# Altium project Demo.PrjPcb (part 1 of 2)
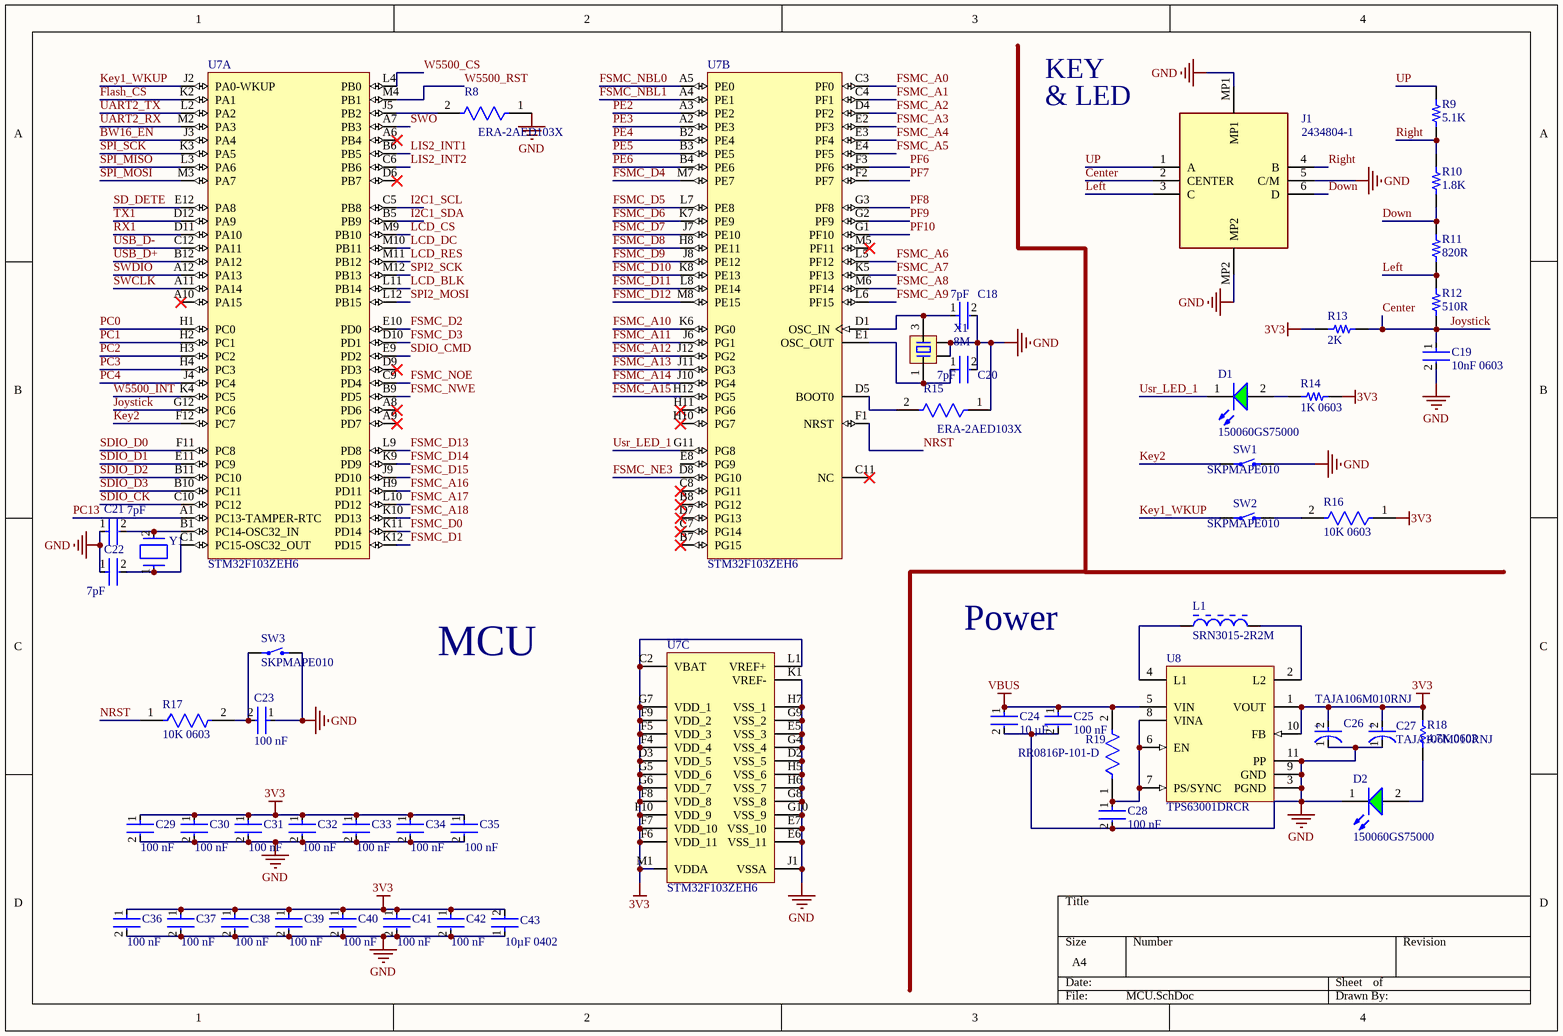
[diagram p0: MCU.SchDoc]
4 sheets, 150 parts. Net scope: global (net labels, ports and power ports of the same name join across sheets).
Board file: PCB1.PcbDoc
Sheets:
  MCU.SchDoc
  Sensors.SchDoc
  Port.SchDoc
  Display_Memory.SchDoc

## Sheet MCU.SchDoc
size A4; SheetNumber: 1; SheetTotal: 4

### Parts
C18  7pF  [FP-GJM155-0_05-IPC_B]
C19  10nF 0603  [FP-CC0603-DA-MFG]
C20  7pF  [FP-GJM155-0_05-IPC_B]
C21  7pF  [FP-GJM155-0_05-IPC_B]
C22  7pF  [FP-GJM155-0_05-IPC_B]
C23  100 nF  [FP-CL10-IPC_A]
C24  10 µF  [FP-CL10-IPC_C]
C25  100 nF  [FP-CL10-IPC_A]
C26  TAJA106M010RNJ  [FP-TAJA-MFG]
C27  TAJA106M010RNJ  [FP-TAJA-MFG]
C28  100 nF  [FP-CL10-IPC_A]
C29  100 nF  [FP-C1005-050-0_05-MFG]
C30  100 nF  [FP-C1005-050-0_05-MFG]
C31  100 nF  [FP-C1005-050-0_05-MFG]
C32  100 nF  [FP-C1005-050-0_05-MFG]
C33  100 nF  [FP-C1005-050-0_05-MFG]
C34  100 nF  [FP-C1005-050-0_05-MFG]
C35  100 nF  [FP-C1005-050-0_05-MFG]
C36  100 nF  [FP-C1005-050-0_05-MFG]
C37  100 nF  [FP-C1005-050-0_05-MFG]
C38  100 nF  [FP-C1005-050-0_05-MFG]
C39  100 nF  [FP-C1005-050-0_05-MFG]
C40  100 nF  [FP-C1005-050-0_05-MFG]
C41  100 nF  [FP-C1005-050-0_05-MFG]
C42  100 nF  [FP-C1005-050-0_05-MFG]
C43  10µF 0402  [FP-CL05A106MP5NUNC-MFG]
D1  150060GS75000  [WL-SMCW_0603_150060xx75000]
D2  150060GS75000  [WL-SMCW_0603_150060xx75000]
J1  2434804-1  [24348041]
L1  SRN3015-2R2M  [BOUR-SRN3015-2_V]
R8  ERA-2AED103X  [FP-ERA2A-IPC_B]
R9  5.1K  [5.1K_0603]
R10  1.8K  [5.1K_0603]
R11  820R  [5.1K_0603]
R12  510R  [5.1K_0603]
R13  2K  [5.1K_0603]
R14  1K 0603  [4.7R]
R15  ERA-2AED103X  [FP-ERA2A-IPC_B]
R16  10K 0603  [FP-RC0603-0_55-IPC_C]
R17  10K 0603  [FP-RC0603-0_55-IPC_C]
R18  4.7K 0603  [RESC1608X55X25LL10T15]
R19  RR0816P-101-D  [FP-RR0816-MFG]
SW1  SKPMAPE010  [KEY-SMD_2P-L6.0-W6.0-P6.00]
SW2  SKPMAPE010  [KEY-SMD_2P-L6.0-W6.0-P6.00]
SW3  SKPMAPE010  [KEY-SMD_2P-L6.0-W6.0-P6.00]
U7  STM32F103ZEH6  [STM-LFBGA144]  (parts A,B,C of 3)
U8  TPS63001DRCR  [DRC0010J_V]
X1  8M  [OSC 3225-4P]
Y1  ABS07-120-32.768KHZ-T  [FP-ABS07-120-MFG]  (value not drawn)

### Nets
3V3: C26.2(A) C27.2(A) C29.1 C30.1 C31.1 C32.1 C33.1 C34.1 C35.1 C36.1 C37.1 C38.1 C39.1 C40.1 C41.1 C42.1 C43.2 R13.2 R14.2 R16.1 R18.2 U7.C2(VBAT) U7.D3(VDD_5) U7.F4(VDD_4) U7.F5(VDD_3) U7.F6(VDD_11) U7.F7(VDD_10) U7.F8(VDD_8) U7.F9(VDD_2) U7.F10(VDD_9) U7.G5(VDD_6) U7.G6(VDD_7) U7.G7(VDD_1) U7.L1(VREF+) U7.M1(VDDA) U8.1(VOUT) U8.10(FB)
GND: C18.2 C19.2 C20.2 C21.1 C22.1 C23.1 C24.2 C25.2 C26.1(C) C27.1(C) C28.2 C29.2 C30.2 C31.2 C32.2 C33.2 C34.2 C35.2 C36.2 C37.2 C38.2 C39.2 C40.2 C41.2 C42.2 C43.1 D2.1(K) J1.5(C/M) J1.MP1 J1.MP2 R8.1 R15.1 SW1.2 SW3.2 U7.D2(VSS_5) U7.E5(VSS_3) U7.E6(VSS_11) U7.E7(VSS_10) U7.G4(VSS_4) U7.G8(VSS_8) U7.G9(VSS_2) U7.G10(VSS_9) U7.H5(VSS_6) U7.H6(VSS_7) U7.H7(VSS_1) U7.J1(VSSA) U7.K1(VREF-) U8.3(PGND) U8.9(GND) U8.11(PP) X1.2 X1.4
VBUS: C24.1 C25.1 R19.2 U8.5(VIN)
BW16_EN: U7.J3(PA4)
Center: C19.1 J1.2(CENTER) R12.1 R13.1 U7.G12(PC6)  [also labelled Joystick]
Down: J1.6(D) R10.1 R11.2
Flash_CS: U7.K2(PA1)
FSMC_A0: U7.C3(PF0)
FSMC_A1: U7.C4(PF1)
FSMC_A2: U7.D4(PF2)
FSMC_A3: U7.E2(PF3)
FSMC_A4: U7.E3(PF4)
FSMC_A5: U7.E4(PF5)
FSMC_A6: U7.L5(PF12)
FSMC_A7: U7.K5(PF13)
FSMC_A8: U7.M6(PF14)
FSMC_A9: U7.L6(PF15)
FSMC_A10: U7.K6(PG0)
FSMC_A11: U7.J6(PG1)
FSMC_A12: U7.J12(PG2)
FSMC_A13: U7.J11(PG3)
FSMC_A14: U7.J10(PG4)
FSMC_A15: U7.H12(PG5)
FSMC_A16: U7.H9(PD11)
FSMC_A17: U7.L10(PD12)
FSMC_A18: U7.K10(PD13)
FSMC_D0: U7.K11(PD14)
FSMC_D1: U7.K12(PD15)
FSMC_D2: U7.E10(PD0)
FSMC_D3: U7.D10(PD1)
FSMC_D4: U7.M7(PE7)
FSMC_D5: U7.L7(PE8)
FSMC_D6: U7.K7(PE9)
FSMC_D7: U7.J7(PE10)
FSMC_D8: U7.H8(PE11)
FSMC_D9: U7.J8(PE12)
FSMC_D10: U7.K8(PE13)
FSMC_D11: U7.L8(PE14)
FSMC_D12: U7.M8(PE15)
FSMC_D13: U7.L9(PD8)
FSMC_D14: U7.K9(PD9)
FSMC_D15: U7.J9(PD10)
FSMC_NBL0: U7.A5(PE0)
FSMC_NBL1: U7.A4(PE1)
FSMC_NE3: U7.D8(PG10)
FSMC_NOE: U7.C9(PD4)
FSMC_NWE: U7.B9(PD5)
I2C1_SCL: U7.C5(PB8)
I2C1_SDA: U7.B5(PB9)
Key1_WKUP: SW2.1 U7.J2(PA0-WKUP)
Key2: SW1.1 U7.F12(PC7)
LCD_BLK: U7.L11(PB14)
LCD_CS: U7.M9(PB10)
LCD_DC: U7.M10(PB11)
LCD_RES: U7.M11(PB12)
Left: J1.3(C) R11.1 R12.2
LIS2_INT1: U7.B6(PB5)
LIS2_INT2: U7.C6(PB6)
NRST: R17.1 U7.F1(NRST)
PC0: U7.H1(PC0)
PC1: U7.H2(PC1)
PC2: U7.H3(PC2)
PC3: U7.H4(PC3)
PC4: U7.J4(PC4)
PC13: U7.A1(PC13-TAMPER-RTC)
PE2: U7.A3(PE2)
PE3: U7.A2(PE3)
PE4: U7.B2(PE4)
PE5: U7.B3(PE5)
PE6: U7.B4(PE6)
PF6: U7.F3(PF6)
PF7: U7.F2(PF7)
PF8: U7.G3(PF8)
PF9: U7.G2(PF9)
PF10: U7.G1(PF10)
Right: J1.4(B) R9.1 R10.2
RX1: U7.D11(PA10)
SD_DETE: U7.E12(PA8)
SDIO_CK: U7.C10(PC12)
SDIO_CMD: U7.E9(PD2)
SDIO_D0: U7.F11(PC8)
SDIO_D1: U7.E11(PC9)
SDIO_D2: U7.B11(PC10)
SDIO_D3: U7.B10(PC11)
SPI2_MOSI: U7.L12(PB15)
SPI2_SCK: U7.M12(PB13)
SPI_MISO: U7.L3(PA6)
SPI_MOSI: U7.M3(PA7)
SPI_SCK: U7.K3(PA5)
SWCLK: U7.A11(PA14)
SWDIO: U7.A12(PA13)
SWO: U7.A7(PB3)
TX1: U7.D12(PA9)
UART2_RX: U7.M2(PA3)
UART2_TX: U7.L2(PA2)
UP: J1.1(A) R9.2
USB_D+: U7.B12(PA12)
USB_D-: U7.C12(PA11)
Usr_LED_1: D1.1(K) U7.G11(PG8)
W5500_CS: U7.L4(PB0)
W5500_INT: U7.K4(PC5)
W5500_RST: U7.M4(PB1)
NetC18_1: C18.1 U7.D1(OSC_IN) X1.3
NetC20_1: C20.1 U7.E1(OSC_OUT) X1.1
NetC21_2: C21.2 U7.B1(PC14-OSC32_IN) Y1.2
NetC22_2: C22.2 U7.C1(PC15-OSC32_OUT) Y1.1
NetC23_2: C23.2 R17.2 SW3.1
NetC28_1: C28.1 R19.1 U8.6(EN) U8.7(PS/SYNC) U8.8(VINA)
NetD1_2: D1.2(A) R14.1
NetD2_2: D2.2(A) R18.1
NetL1_1: L1.1 U8.4(L1)
NetL1_2: L1.2 U8.2(L2)
NetR8_2: R8.2 U7.J5(PB2)
NetR15_2: R15.2 U7.D5(BOOT0)
NetR16_2: R16.2 SW2.2

Not connected (* = marked no-connect by the designer): U7 A6(PB4)* A8(PD6)* A9(PD7)* A10(PA15)* B7(PG15)* B8(PG12)* C7(PG14)* C8(PG11)* C11(NC)* D6(PB7)* D7(PG13)* D9(PD3)* E8(PG9) H10(PG7)* H11(PG6)* M5(PF11)*

### Notes on the sheet
- KEY
- & LED
- Power
- MCU
- (in symbol CMP-2000-07219-2) +

### Library data of the parts
C18 C20-C22 = CMP-2008-03877-2: Multi-Layer Ceramic Capacitor 7pF C0G  ±0.5pF 0402 Paper T/R; Voltage Rating (DC): 50V; Case/Package: 0402; Mount: Surface Mount; Max Operating Temperature: 125°C; Case Code (Imperial): 0402; Min Operating Temperature: -55°C; Width: 0.02inch; Weight: 2.3E-05oz; Termination: SMD/SMT; Package Quantity: 10000; Packaging: Tape and Reel; Thickness: 0.022inch; Dielectric: C0G; Length: 1mm; Voltage Rating: 50V; Height: 0.5mm; Capacitance: 7pF; Radiation Hardening: No; Depth: 0.5mm; Case Code (Metric): 1005
C19 = CMP-2100-03600-2: CAP CER 10000PF 50V X7R 0603; Manufacturer Part Number: CC0603KRX7R9BB103; Manufacturer: YAGEO; Tolerance: 0.1; Material: Ceramic; Temperature Coefficient: 15%; Mouser Description: Multilayer Ceramic Capacitor, CC Series, 0.01 - F, - 10%, X7R, 50 V, 0603 [1608 Metric]; Digikey Description: CAP CER 10000PF 50V X7R 0603; Height: 0.9mm; Category: Cap; Temperature Characteristic: X7R; Footprint Url: http://www.yageo.com/exep/pages/download/literatures/UPY-C_GEN_24.pdf; Lead Free: Yes; Voltage Rating: 50 V; Temperature: -55°C to +125°C; Device Class L3: Ceramic Capacitors; ComponentLink2Description: Datasheet; Voltage: 50 V; Package: CC0603-DA; Octopart: https://octopart.com/cc0603krx7r9bb103-yageo-192938; Automotive: No; Temperature Range High: +125°C; Temperature Range Low: -55°C; Value: 10 nF; RoHS: TRUE; Device Class L1: Passive Components; ComponentLink2URL: http://www.yageo.com/documents/recent/UPY-GPHC_X7R_6.3V-to-50V_18.pdf; Device Class L2: Capacitors; Capacitance: 10 nF
C23 C25 C28 = CMP-13271-004036-1: Cap Ceramic 100nF 100V X7R ±10% Pad SMD 0603 +125°C T/R; Mount: Surface Mount; Packaging: Cut Tape; Width: 0.031inch; Thickness: 0.035inch; Length: 0.063inch; Tolerance: 10%; Min Operating Temperature: -55°C; Case/Package: 0603; Voltage Rating: 100V; Max Operating Temperature: 125°C; Case Code (Metric): 1608; Capacitance: 100nF; Case Code (Imperial): 0603
C24 = CMP-13271-004224-1: Cap Ceramic 10uF 25V X5R ±20% Pad SMD 0603 +85°C T/R; Width: 0.031inch; Voltage Rating: 25V; Length: 0.063inch; Case Code (Metric): 1608; Dielectric: X5R; Termination: Wraparound; Capacitance: 10uF; Lead Free: Lead Free; Mount: Surface Mount; Package Quantity: 1; Case Code (Imperial): 0603; Thickness: 0.035inch; Packaging: Tape and Reel; Contact Plating: Tin; Min Operating Temperature: -55°C; Tolerance: 20%; Max Operating Temperature: 85°C; Case/Package: 0603
C26 C27 = CMP-2000-07219-2: 10uF 10V  ±20% 3Ω 1206  SMD Tantalum Capacitor; Polarity: Polar; ESR (Equivalent Series Resistance): 3R; Dissipation Factor: 6%; Leakage Current: 1uA; Construction: Flat; Packaging: Tape and Reel; Voltage Rating: 10V; Lead Free: Lead Free; Radiation Hardening: No; REACH SVHC: No SVHC; Termination: SMD/SMT; Case/Package: 1206; RoHS Compliant: Yes; Min Operating Temperature: -55°C; Depth: 1.6mm; Voltage Rating (DC): 10V; Series: TAJ; Capacitance: 10uF; Height: 1.6mm; Height - Seated (Max): 0.071inch; Tolerance: 20%; Package Quantity: 1; Voltage: 10V; Features: General Purpose; Max Operating Temperature: 125°C; Lead Pitch: 1.1mm; Dielectric Material: Tantalum; Width: 0.063inch; Mount: Surface Mount; Case Code (Metric): 3216; Case Code (Imperial): 1206; Length: 3.2mm; Number of Pins: 2
C29-C42 = CMP-08246-004802-1: Multilayer Ceramic Capacitors 100nF ±10% 50V X5R SMD 0402; Voltage Rating: 50V; Weight: 2.3E-05oz; Construction: Flat; Dielectric: X5R; Packaging: Tape and Reel; REACH SVHC: No SVHC; Width: 0.02inch; RoHS Compliant: Yes; Capacitance: 100nF; Depth: 0.5mm; Voltage Rating (DC): 50V; Dielectric Material: Ceramic; Height: 0.5mm; Min Operating Temperature: -55°C; Voltage: 50V; Case Code (Imperial): 0402; Tolerance: 10%; Termination: SMD/SMT; Package Quantity: 1; Radiation Hardening: No; Resistor Type: Ceramic; Case/Package: 0402; Length: 1mm; Lead Free: Lead Free; Thickness: 0.022inch; Mount: Surface Mount; Case Code (Metric): 1005; Max Operating Temperature: 85°C; Series: C
C43 = CMP-13271-000002-1: CAP CER 10UF 10V X5R 0402; Manufacturer Part Number: CL05A106MP5NUNC; Manufacturer: Samsung; Temperature Coefficient: 15%; Tolerance: 20%; Material: Ceramic; Octopart: https://octopart.com/cl05a106mp5nunc-samsung-22457395; Voltage Rating: 10V; RoHS: TRUE; Value: 10uF; Height: 0.7mm; Digikey Description: CAP CER 10UF 10V X5R 0402; Automotive: No; Package: CL05A106MP5NUNC; Device Class L1: Passive Components; Capacitance: 10uF; Temperature Range High: +85°C; ComponentLink2Description: Datasheet; Device Class L2: Capacitors; Temperature Characteristic: X5R; Temperature: -55°C to +85°C; ComponentLink2URL: http://www.samsungsem.com/kr/support/product-search/mlcc/__icsFiles/afieldfile/2019/05/10/19-CL05A106MP5NUNC.pdf; Device Class L3: Ceramic Capacitors; Category: Cap; Temperature Range Low: -55°C; Ipc Land Pattern Name: CAPC10050X50; Lead Free: Yes
D1 D2 = CMP-1426-00002-3: NexarPartId: 29687084; Color: Green; Power Dissipation: 105mW; Peak Wavelength: 515nm; Viewing Angle: 140°; Test Current: 20mA; Wavelength: 520nm; Lens Style: Clear, Rectangular; Max Junction Temperature (Tj): 95°C; Luminous Intensity: 430mcd; Output Current: 10µA; Max Reverse Voltage (DC): 5V; Forward Voltage: 3.2V; Dominant Wavelength: 525nm; Forward Current: 100mA; Mount: Surface Mount; Height: 700µm; Lead Free: Lead Free; Min Operating Temperature: -40°C; Max Operating Temperature: 85°C; Length: 1.6mm; Width: 800µm; Case/Package: 0603; Case Code (Imperial): 0603; Case Code (Metric): 1608; Packaging: Tape and Reel; Reverse Voltage: 5V; REACH SVHC: Unknown; RoHS: Compliant
J1 = 2434804-1: Tactile Switches, Extended, Top Actuator Style, NO, Stainless Steel, Silver, Low Profile, 50 mA, 12 VDC; Manufacturer_Name: TE Connectivity; Geometry.Height: 5.7mm; Manufacturer_Part_Number: 2434804-1; Mouser Part Number: 655-2434804-1; Mouser Price/Stock: https://www.mouser.co.uk/ProductDetail/TE-Connectivity-Alcoswitch/2434804-1?qs=amGC7iS6iy%2Ff1nJtCucIMQ%3D%3D; Arrow Part Number: *; Arrow Price/Stock: *; Datasheet Link: https://www.te.com/commerce/DocumentDelivery/DDEController?Action=showdoc&DocId=Customer+Drawing%7F2434804%7FA%7Fpdf%7FEnglish%7FENG_CD_2434804_A.pdf%7F2434804-1
L1 = CMP-0007-00003-1: Semi-shielded Power Inductor, 2.2 uH, +/- 20%, 1.8 A, -40 to 125 degC, 3 x 3 x 1.5 mm SMD, RoHS and Halogen Free, Tape and Reel; Manufacturer: Bourns; Isat: 1.65 A; Rated current: 1.8 A; Inductance: 2.2 uH; Inductance tolerance: +/- 20%; DCR Max: 0.072 Ohm; SRF Min: 90 MHz; Resistance to Solder Heat: +260 degC for 10 sec.; Operating Temperature: -40 to 125 degC; PartNumber: SRN3015-2R2M; Packing: Tape and Reel; ComponentLink3Description: Package Specification; ComponentLink2Description: Datasheet; RoHS: TRUE; ComponentLink3URL: http://www.bourns.com/data/global/pdfs/SRN3015.pdf; PackageDescription: 2-Pin SMD, Body 3 x 3 mm, Height 1.5 mm; ComponentLink1URL: http://www.bourns.com/; ComponentLink1Description: Manufacturer URL; DatasheetVersion: Aug-11; Mounting Technology: Surface Mount; ComponentLink2URL: http://www.bourns.com/data/global/pdfs/SRN3015.pdf; PackageReference: SRN3015
R8 R15 = CMP-2002-05836-2: RES SMD 10K OHM 0.5% 1/16W 0402; Voltage Rating: 25V; Power Rating: 63mW; Resistance: 10kR; Temperature Coefficient: 25ppm/°C; Height: 0.016inch; Military Standard: Not; Width: 0.5mm; Series: ERA-2A; Packaging: Tape and Reel; Number of Terminations: 2; REACH SVHC: No SVHC; RoHS Compliant: Yes; Mount: Surface Mount; Weight: 2.8E-05oz; Resistance Tolerance: 0.5%; Tolerance: 0.5%; Package Quantity: 10000; Min Operating Temperature: -55°C; Case Code (Metric): 1005; Resistor Type: Thin Film; Construction: Rectangular; Depth: 0.5mm; Case Code (Imperial): 0402; Max Power Dissipation: 63mW; Max Operating Temperature: 155°C; Contact Plating: Tin; Length: 1mm; Size Code: 0402; Termination: SMD/SMT; Case/Package: 0402; Voltage Rating (DC): 25V; Lead Free: Lead Free
R9-R13 = 5.1K_0603: SMT Resistor
R14 = 4.7R 0603: SMT Resistor
R16 R17 = CMP-2100-03664-2: RES 10K OHM 1% 1/10W 0603; Voltage Rating: 75V; Voltage Rating (DC): 50V; Resistance: 10kR; Power Rating: 100mW; Temperature Coefficient: 100ppm/°C; Depth: 0.8mm; Termination: SMD/SMT; Resistor Type: Thick Film; Series: RC; Construction: Rectangular; Features: Moisture Resistant; Packaging: Tape and Reel; Min Operating Temperature: -55°C; Number of Terminations: 2; Lead Pitch: 0.3mm; RoHS Compliant: Yes; Case/Package: 0603; Resistance Tolerance: 1%; Military Standard: Not; Weight: 7.1E-05oz; Number of Pins: 2; Tolerance: 1%; Length: 1.6mm; Case Code (Imperial): 0603; Lead Free: Lead Free; Width: 0.8mm; Max Power Dissipation: 100mW; Height: 0.45mm; Max Operating Temperature: 155°C; Case Code (Metric): 1608; Size Code: 0603
R18 = CMP-2000-06942-1: Chip Resistor, 4.7 KOhm, +/- 1%, 0.1 W, -55 to 155 degC, 0603 (1608 Metric), RoHS, Tape and Reel; Manufacturer: Yageo; Power Rating: 100mW; Temperature Coefficient: 100PPM/C; Resistance: 4.7kOhms; Voltage Rating: 50V; Package Reference: 0603; Series: RC; Datasheet Version: Rev. 7, 05/2017; Packaging: Reel; Termination Style: SMD/SMT; Datasheet URL: http://www.yageo.com/documents/recent/PYu-RC_Group_51_RoHS_L_7.pdf; Manufacturer URL: http://www.yageo.com/; Package Description: 2-Pin Surface Mount Device, Body 1.6 x 0.8 mm; Case Code - mm: 1608; Case Code - in: 0603; Mounting Technology: SurfaceMount; Operating Temperature Range: -55Cto+155C; Tolerance: 1%; Product: ThickFilmResistorsGeneralPurpose
R19 = CMP-2000-02416-2: 100Ω ±0.5% 0.0625W 1/16W Chip Resistor 0603 (1608 Metric) Thin Film; Voltage Rating: 75V; Power Rating: 63mW; Resistance: 100R; Temperature Coefficient: 25ppm/°C; Number of Terminations: 2; Resistance Tolerance: 0.5%; Termination: SMD/SMT; Tolerance: 0.5%; Case/Package: 0603; Series: RR; Min Operating Temperature: -55°C; Case Code (Imperial): 0603; Number of Pins: 2; Packaging: Cut Tape; Width: 0.031inch; Resistor Type: Thin Film; RoHS Compliant: Yes; Lead Free: Lead Free; Depth: 0.8mm; Technology: THIN FILM; Size Code: 0603; Voltage Rating (DC): 75V; Package Quantity: 1; Case Code (Metric): 1608; Length: 1.6mm; Height: 0.4mm; Max Operating Temperature: 125°C; Weight: 7.1E-05oz; Max Power Dissipation: 63mW
U7 = CMP-0237-00023-3: ARM Cortex-M3 32-bit MCU, 512 KB Flash, 64 KB Internal RAM, 112 I/Os, 144-pin LFBGA, -40 to 85 degC, Tray; Operating Frequency(F) (Processor speed) (MHz): 72; Internal RAM Size (kB): 64; Supply Voltage(Vcc) min (V): 2; D/A Converter: 2x12-bit (2 Channel); A/D Converter: 3x12-bit (21 Channel); FLASH Size (Prog) (kB): 512; I/Os (High Current): 112; PackageVersion: Rev. 3, 01/2012; Packing: Tray; PackageDescription: 144-Ball Low Profile Fine Pitch BGA, 10 x 10 x 1.7 mm Body, 0.8 mm Pitch; ComponentLink2URL: http://www.st.com/st-web-ui/static/active/en/resource/technical/document/datasheet/CD00191185.pdf; ComponentLink3Description: Package Specification; Core: ARM Cortex-M3; PartNumber: STM32F103ZEH6; ComponentLink1Description: Manufacturer URL; ComponentLink3URL: http://www.st.com/st-web-ui/static/active/en/resource/technical/document/datasheet/CD00253742.pdf; PackageReference: LFBGA144; ComponentLink1URL: http://www.st.com/web/en/home.html; DatasheetVersion: Rev. 8; Mounting Technology: Surface Mount; ComponentLink2Description: Datasheet
U8 = CMP-0345-00006-2: Buck-Boost Voltage Converter with 1.8 to 5.5 V Input and 3.3 V Output, -40 to 85 degC, 10-Pin SON (DRC), Green (RoHS & no Sb/Br); Manufacturer: Texas Instruments; Synchronous Rectification: TRUE; Iq(Typ)(mA): 0.03; Regulated Outputs(#): 1; Preset Vout(V): 3.3; Vin(Min)(V): 1.8; Switching Frequency(Max)(kHz): 1500; Iout(Max)(A): 1.2; SubFamily: Buck-Boost Regulator; Vin(Max)(V): 5.5; PartNumber: TPS63001DRCR; Topology: Buck-Boost; Dynamic Voltage Scaling: TRUE; PackageVersion: revL, Sep-2011; ComponentLink2Description: Package Specification; DatasheetVersion: SLVS520B; Eco-Plan: Green (RoHS & no Sb/Br); ComponentLink1URL: http://www.ti.com/general/docs/lit/getliterature.tsp?genericPartNumber=TPS63001&fileType=pdf; Mounting Technology: Surface Mount; Vout(Min)(V): 3.3; ComponentLink2URL: http://www.ti.com/litv/pdf/mpds117k; PackageDescription: 10-Pin Plastic Small Outline No-Lead, 3 x 3 x 1 mm Body, 0.5 mm Pitch, Exposed Pad; PackageReference: DRC0010J; Vout(Max)(V): 3.3; ComponentLink1Description: Datasheet
X1 = XTAL-4P: BOM名称: 4脚无源晶振; 版权归属: 源创客; 学习资源: www.ooocke.com
Y1 = CMP-2000-07587-2: CRYSTAL 32.7680KHZ 6PF SMD; Frequency Tolerance: 20ppm; Series Resistance: 60kR; ESR (Equivalent Series Resistance): 55kR; Depth: 1.5mm; Width: 0.061inch; Number of Pins: 2; Max Operating Temperature: 85°C; Length: 3.2mm; Case/Package: SMD/SMT; Series: ABS07; Lead Free: Lead Free; Min Operating Temperature: -40°C; Load Capacitance: 6pF; Packaging: Tape and Reel; Height: 0.035inch; Radiation Hardening: No; Tolerance: 20ppm; Operating Frequency: 32.768 kHz; Termination: SMD/SMT; REACH SVHC: No SVHC; RoHS Compliant: Yes; Frequency: 32.768kHz; Package Quantity: 3000; Mount: Surface Mount

## Sheet Sensors.SchDoc
size A4; SheetNumber: 2; SheetTotal: 4
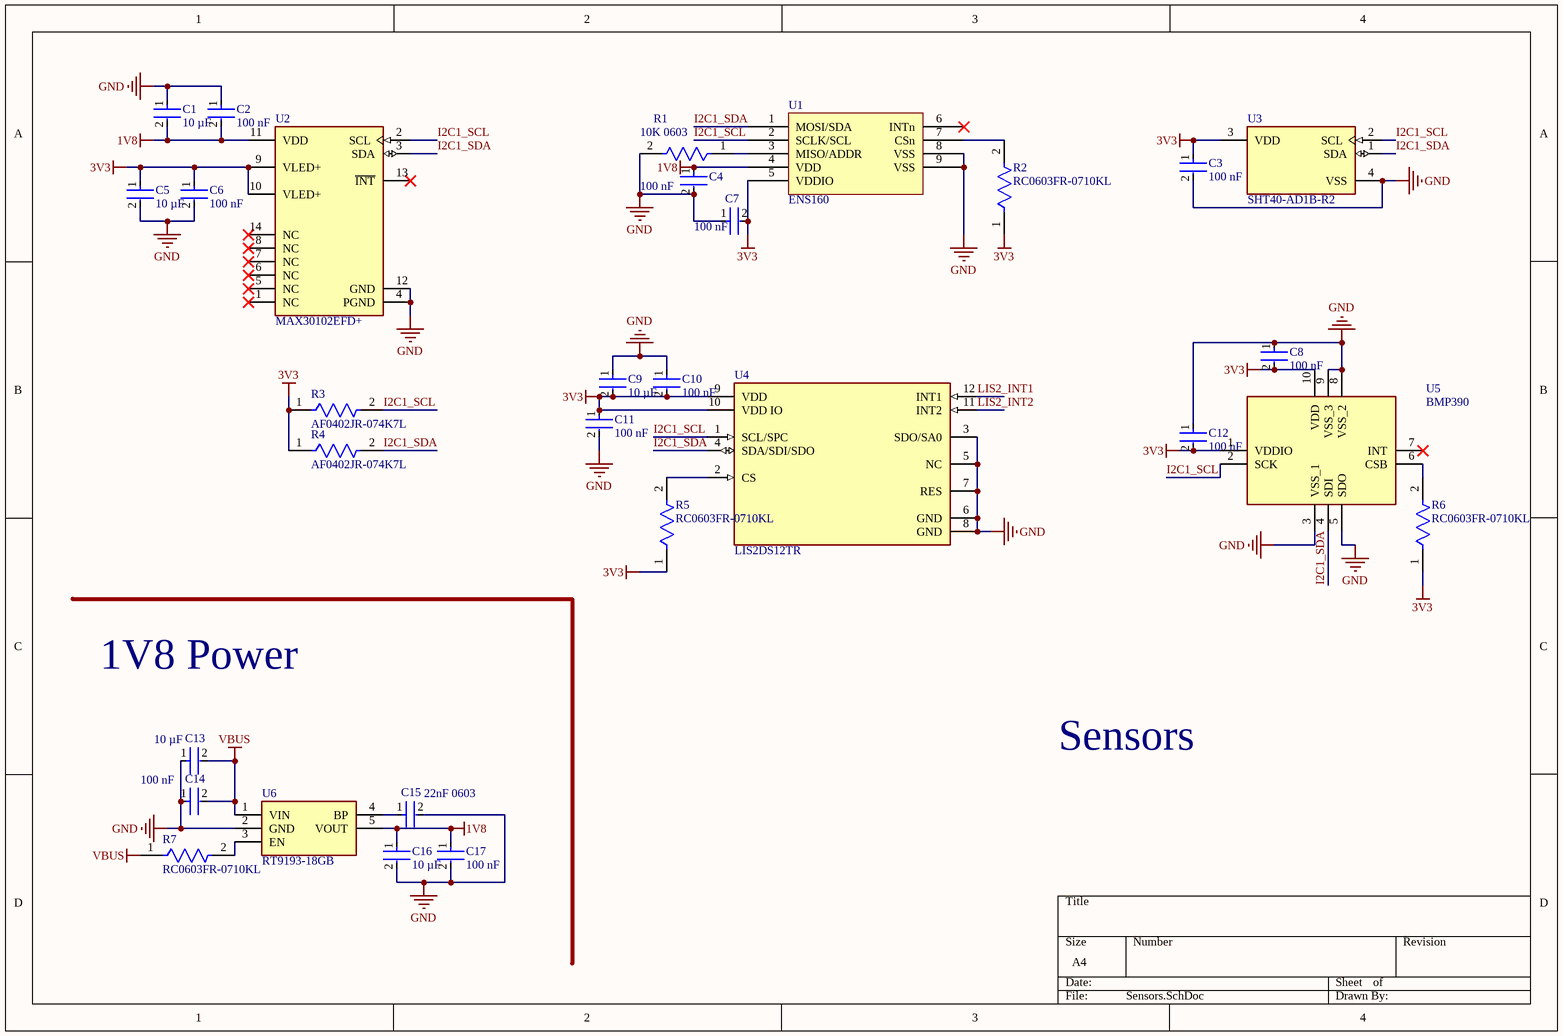
[diagram p1: Sensors.SchDoc]

### Parts
C1  10 µF  [FP-CL10-IPC_C]
C2  100 nF  [FP-CL10-IPC_A]
C3  100 nF  [FP-CL10-IPC_A]
C4  100 nF  [FP-CL10-IPC_A]
C5  10 µF  [FP-CL10-IPC_C]
C6  100 nF  [FP-CL10-IPC_A]
C7  100 nF  [FP-CL10-IPC_A]
C8  100 nF  [FP-CL10-IPC_A]
C9  10 µF  [FP-CL10-IPC_C]
C10  100 nF  [FP-CL10-IPC_A]
C11  100 nF  [FP-CL10-IPC_A]
C12  100 nF  [FP-CL10-IPC_A]
C13  10 µF  [FP-CL10-IPC_C]
C14  100 nF  [FP-CL10-IPC_A]
C15  22nF 0603  [FP-0603-L_1_6_0_15-W_0_81-IPC_C]
C16  10 µF  [FP-CL10-IPC_C]
C17  100 nF  [FP-CL10-IPC_A]
R1  10K 0603  [FP-RC0603-0_55-IPC_C]
R2  RC0603FR-0710KL  [FP-RC0603-0_55-IPC_C]
R3  AF0402JR-074K7L  [FP-AF0402-IPC_B]
R4  AF0402JR-074K7L  [FP-AF0402-IPC_B]
R5  RC0603FR-0710KL  [FP-RC0603-0_55-IPC_C]
R6  RC0603FR-0710KL  [FP-RC0603-0_55-IPC_C]
R7  RC0603FR-0710KL  [FP-RC0603-0_55-IPC_C]
U1  ENS160  [ENS_160]
U2  MAX30102EFD+  [FP-F143A5-1-MFG]
U3  SHT40-AD1B-R2  [FP-SHT40-AD1B-R2-MFG]
U4  LIS2DS12TR  [FP-LGA12_8566956-MFG]
U5  BMP390  [BMP390]
U6  RT9193-18GB  [SOT94P279X130-5N]

### Nets
1V8: C1.2 C2.2 C4.1 C16.1 C17.1 U1.4(VDD) U2.11(VDD) U6.5(VOUT)
3V3: C3.1 C5.1 C6.1 C7.2 C8.2 C9.2 C10.2 C11.1 C12.2 R2.1 R3.1 R4.1 R5.1 R6.1 U1.5(VDDIO) U2.9(VLED+) U2.10(VLED+) U3.3(VDD) U4.9(VDD) U4.10(VDD_IO) U5.1(VDDIO) U5.10(VDD)
GND: C1.1 C2.1 C3.2 C4.2 C5.2 C6.2 C7.1 C8.1 C9.1 C10.1 C11.2 C12.1 C13.1 C14.1 C15.2 C16.2 C17.2 R1.2 U1.8(VSS) U1.9(VSS) U2.4(PGND) U2.12(GND) U3.4(VSS) U4.3(SDO/SA0) U4.5(NC) U4.6(GND) U4.7(RES) U4.8(GND) U5.3(VSS_1) U5.5(SDO) U5.8(VSS_2) U5.9(VSS_3) U6.2(GND)
VBUS: C13.2 C14.2 R7.1 U6.1(VIN)
I2C1_SCL: R3.2 U1.2(SCLK/SCL) U2.2(SCL) U3.2(SCL) U4.1(SCL/SPC) U5.2(SCK)
I2C1_SDA: R4.2 U1.1(MOSI/SDA) U2.3(SDA) U3.1(SDA) U4.4(SDA/SDI/SDO) U5.4(SDI)
LIS2_INT1: U4.12(INT1)
LIS2_INT2: U4.11(INT2)
NetC15_1: C15.1 U6.4(BP)
NetR1_1: R1.1 U1.3(MISO/ADDR)
NetR2_2: R2.2 U1.7(CSn)
NetR5_2: R5.2 U4.2(CS)
NetR6_2: R6.2 U5.6(CSB)
NetR7_2: R7.2 U6.3(EN)

Not connected (* = marked no-connect by the designer): U1 6(INTn)*; U2 1(NC)* 5(NC)* 6(NC)* 7(NC)* 8(NC)* 13(~{INT})* 14(NC)*; U5 7(INT)*

### Notes on the sheet
- 1V8 Power
- Sensors

### Library data of the parts
C1 C5 C9 C13 C16 = CMP-13271-004224-1: as C24 on sheet MCU; Width: 0.031inch; Voltage Rating: 25V; Length: 0.063inch; Case Code (Metric): 1608; Dielectric: X5R; Termination: Wraparound; Capacitance: 10uF; Lead Free: Lead Free; Mount: Surface Mount; Package Quantity: 1; Case Code (Imperial): 0603; Thickness: 0.035inch; Packaging: Tape and Reel; Contact Plating: Tin; Min Operating Temperature: -55°C; Tolerance: 20%; Max Operating Temperature: 85°C; Case/Package: 0603
C2-C4 C6-C8 C10-C12 C14 C17 = CMP-13271-004036-1: as C23 on sheet MCU; Mount: Surface Mount; Packaging: Cut Tape; Width: 0.031inch; Thickness: 0.035inch; Length: 0.063inch; Tolerance: 10%; Min Operating Temperature: -55°C; Case/Package: 0603; Voltage Rating: 100V; Max Operating Temperature: 125°C; Case Code (Metric): 1608; Capacitance: 100nF; Case Code (Imperial): 0603
C15 = CMP-2006-04170-2: General Purpose Ceramic Capacitor, 0603, 22nF, 10%, X7R, 15%, 25V; Max Operating Temperature: 125°C; Lead Free: Lead Free; Voltage Rating (DC): 25V; Packaging: Tape and Reel; Thickness: 0.035inch; Length: 1.6mm; Series: -; Dielectric: X7R; Min Operating Temperature: -55°C; Mount: Surface Mount; Tolerance: 10%; Contact Plating: Tin; Construction: Flat; Package Quantity: 1; Case Code (Imperial): 0603; Number of Pins: 2; Termination: SMD/SMT; Case/Package: 0603; Radiation Hardening: No; Dielectric Material: Ceramic; Case Code (Metric): 1608; Width: 0.032inch; Height: 0.9mm; Depth: 0.81mm; Capacitance: 22nF; Voltage: 25V; RoHS Compliant: Yes; Voltage Rating: 25V
R1 R2 R5-R7 = CMP-2100-03664-2: as R16 on sheet MCU; Depth: 0.8mm; Termination: SMD/SMT; Resistor Type: Thick Film; Series: RC; Construction: Rectangular; Features: Moisture Resistant; Packaging: Tape and Reel; Min Operating Temperature: -55°C; Number of Terminations: 2; Lead Pitch: 0.3mm; RoHS Compliant: Yes; Case/Package: 0603; Resistance Tolerance: 1%; Military Standard: Not; Weight: 7.1E-05oz; Number of Pins: 2; Tolerance: 1%; Length: 1.6mm; Case Code (Imperial): 0603; Lead Free: Lead Free; Width: 0.8mm; Max Power Dissipation: 100mW; Height: 0.45mm; Max Operating Temperature: 155°C; Case Code (Metric): 1608; Size Code: 0603
R3 R4 = CMP-03412-040740-1: Anti-Sulfurated Chip Resistors Automotive Grade 4.7kΩ 5% 100ppm/°C 0402; Voltage Rating: 50V; Power Rating: 62.5mW; Max Power Dissipation: 63mW; Resistance: 4.7kR; Width: 0.5mm; Case Code (Imperial): 0402; Package Quantity: 10000; Max Operating Temperature: 155°C; Features: Moisture Resistant; Length: 0.039inch; Height: 0.015inch; RoHS Compliant: Yes; Temperature Coefficient: 100ppm/°C; Resistor Type: Thick Film; Weight: 2.3E-05oz; Case Code (Metric): 1005; Packaging: Tape and Reel; Series: AF; Termination: SMD/SMT; Tolerance: 5%; Case/Package: 0402; Number of Terminations: 2; Min Operating Temperature: -55°C
U2 = CMP-05738-000003-1: IC SENSOR OXIMETER/HEARTRATE; Manufacturer: Maxim Integrated; Max Supply Voltage: 2V; Operating Supply Current: 600uA; Min Supply Voltage: 1.7V; Sensor Output: I2C; Max Junction Temp: +90°C; Category: IC; Automotive: No; Height: 1.65mm; Temperature Range Low: -40°C; Footprint Url: https://pdfserv.maximintegrated.com/land_patterns/90-0602.PDF; Octopart: https://octopart.com/max30102efd%2B-maxim+integrated-59568799; Temperature: -40°C to +85°C; ComponentLink2URL: https://datasheets.maximintegrated.com/en/ds/MAX30102.pdf; ComponentLink2Description: Datasheet; Device Class L3: unset; Device Class L2: unset; Mouser Description: Pulse Oximeter/Heart Rate Sensor, Oesip; Lead Free: Yes; Digikey Description: IC SENSOR OXIMETER/HEARTRATE; Package: F143A5-1; Manufacturer Part Number: MAX30102EFD+; RoHS: TRUE; Device Class L1: Sensors; Temperature Range High: +85°C
U3 = CMP-144040-000008-1: SENSOR HUMIDITY 100 RH SMD
U4 = CMP-12175-000010-1: ACCEL 2-16G I2C/SPI 12LGA; Operating Supply Voltage: 1.98V; Bandwidth: 6.25Hz; Axis: X, Y, Z; Output Type: SPI; Case/Package: LGA; Min Operating Temperature: -40°C; Lead Free: Lead Free; Mount: Surface Mount; Max Operating Temperature: 85°C; Contact Plating: Gold; Number of Pins: 12; Packaging: Tape and Reel
U5 = BMP390: Board Mount Pressure Sensors
U6 = RT9193-18GB: IC REG LINEAR 1.8V 300MA SOT23-5; Manufacturer_Name: RICHTEK; Geometry.Height: 1.295mm; Manufacturer_Part_Number: RT9193-18GB; Mouser Part Number: *; Mouser Price/Stock: *; Arrow Part Number: *; Arrow Price/Stock: *; Datasheet Link: http://www.richtek.com/assets/product_file/RT9193/DS9193-17.pdf

## Sheet Port.SchDoc
size A4; SheetNumber: 3; SheetTotal: 4
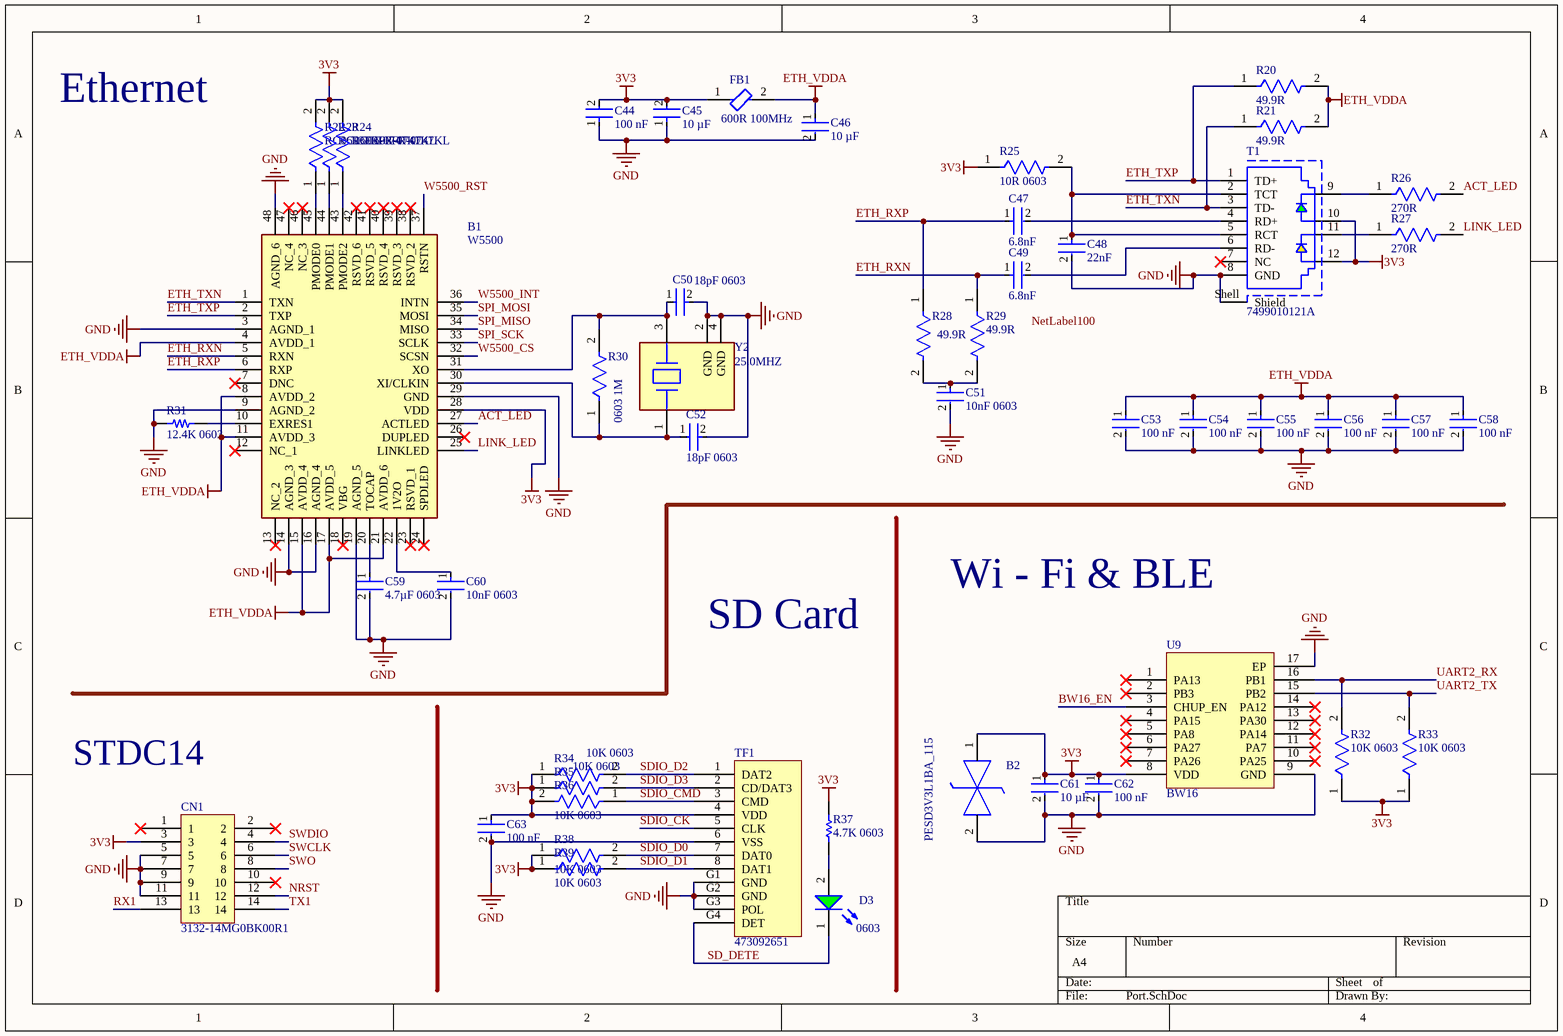
[diagram p2: Port.SchDoc]

### Parts
B1  W5500  [W5500]
B2  PESD3V3L1BA_115  [SOD2512X110N]
C44  100 nF  [FP-CL10-IPC_A]
C45  10 µF  [FP-CL10-IPC_C]
C46  10 µF  [FP-CL10-IPC_C]
C47  6.8nF  [FP-CC0603-DA-MFG]
C48  22nF  [FP-CC0603-DA-MFG]
C49  6.8nF  [FP-CC0603-DA-MFG]
C50  18pF 0603  [FP-C1608-080-0_1-IPC_C]
C51  10nF 0603  [FP-CC0603-DA-MFG]
C52  18pF 0603  [FP-C1608-080-0_1-IPC_C]
C53  100 nF  [FP-CL10-IPC_A]
C54  100 nF  [FP-CL10-IPC_A]
C55  100 nF  [FP-CL10-IPC_A]
C56  100 nF  [FP-CL10-IPC_A]
C57  100 nF  [FP-CL10-IPC_A]
C58  100 nF  [FP-CL10-IPC_A]
C59  4.7µF 0603  [FP-C0603-CG-MFG]
C60  10nF 0603  [FP-CC0603-DA-MFG]
C61  10 µF  [FP-CL10-IPC_C]
C62  100 nF  [FP-CL10-IPC_A]
C63  100 nF  [FP-CL10-IPC_A]
CN1  3132-14MG0BK00R1  [STDC14 Header]
D3  0603  [WL-SMCW_0603_150060xx75000]
FB1  600R 100MHz  [FP-BLM18-0_15-t0_8-MFG]
R20  49.9R  [FP-RT0603-MFG]
R21  49.9R  [FP-RT0603-MFG]
R22  RC0603FR-0747KL  [FP-RC0603FR-0747KL-MFG]
R23  RC0603FR-0747KL  [FP-RC0603FR-0747KL-MFG]
R24  RC0603FR-0747KL  [FP-RC0603FR-0747KL-MFG]
R25  10R 0603  [FP-RT0603-MFG]
R26  270R  [FP-RT0603-MFG]
R27  270R  [FP-RT0603-MFG]
R28  49.9R  [FP-RT0603-MFG]
R29  49.9R  [FP-RT0603-MFG]
R30  0603 1M  [FP-RC0603-0_55-IPC_C]
R31  12.4K 0603  [4.7R]
R32  10K 0603  [FP-RC0603-0_55-IPC_C]
R33  10K 0603  [FP-RC0603-0_55-IPC_C]
R34  10K 0603  [FP-RC0603-0_55-IPC_C]
R35  10K 0603  [FP-RC0603-0_55-IPC_C]
R36  10K 0603  [FP-RC0603-0_55-IPC_C]
R37  4.7K 0603  [RESC1608X55X25LL10T15]
R38  10K 0603  [FP-RC0603-0_55-IPC_C]
R39  10K 0603  [FP-RC0603-0_55-IPC_C]
T1  7499010121A  [7499010121A]
TF1  473092651  [TF-SMD_47309-2285]
U9  BW16  [BW16]
Y2  25.0MHZ  [FP-ABM8G-MFG]

### Nets
3V3: B1.28(VDD) B2.1(K1) C44.2 C45.2 C61.1 C62.1 C63.1 CN1.3 FB1.1 R22.2 R23.2 R24.2 R25.1 R32.1 R33.1 R34.1 R35.1 R36.2 R37.1 R38.1 R39.1 T1.10 T1.12 TF1.4(VDD) U9.8(VDD)
ETH_VDDA: B1.4(AVDD_1) B1.8(AVDD_2) B1.11(AVDD_3) B1.15(AVDD_4) B1.17(AVDD_5) B1.21(AVDD_6) C46.1 C53.1 C54.1 C55.1 C56.1 C57.1 C58.1 FB1.2 R20.2 R21.2
GND: B1.3(AGND_1) B1.9(AGND_2) B1.14(AGND_3) B1.16(AGND_4) B1.19(AGND_5) B1.29(GND) B1.48(AGND_6) B2.2(K2) C44.1 C45.1 C46.2 C48.2 C50.2 C51.2 C52.2 C53.2 C54.2 C55.2 C56.2 C57.2 C58.2 C59.2 C60.2 C61.2 C62.2 C63.2 CN1.5 CN1.7 CN1.9 CN1.11 R31.2 T1.8(GND) T1.Shell(Shield) TF1.6(VSS) TF1.G1(GND) TF1.G2(GND) TF1.G3(POL) U9.9(GND) U9.17(EP) Y2.2(GND) Y2.4(GND)
ACT_LED: B1.27(ACTLED) R26.2
BW16_EN: U9.3(CHUP_EN)
ETH_RXN: B1.5(RXN) C49.1 R29.1
ETH_RXP: B1.6(RXP) C47.1 R28.1
ETH_TXN: B1.1(TXN) R21.1 T1.3(TD-)
ETH_TXP: B1.2(TXP) R20.1 T1.1(TD+)
LINK_LED: B1.25(LINKLED) R27.2
NRST: CN1.12
RX1: CN1.13
SD_DETE: D3.1(K) TF1.G4(DET)
SDIO_CK: TF1.5(CLK)
SDIO_CMD: R36.1 TF1.3(CMD)
SDIO_D0: R38.2 TF1.7(DAT0)
SDIO_D1: R39.2 TF1.8(DAT1)
SDIO_D2: R34.2 TF1.1(DAT2)
SDIO_D3: R35.2 TF1.2(CD/DAT3)
SPI_MISO: B1.34(MISO)
SPI_MOSI: B1.35(MOSI)
SPI_SCK: B1.33(SCLK)
SWCLK: CN1.6
SWDIO: CN1.4
SWO: CN1.8
TX1: CN1.14
UART2_RX: R32.2 U9.16(PB1)
UART2_TX: R33.2 U9.15(PB2)
W5500_CS: B1.32(SCSN)
W5500_INT: B1.36(INTN)
W5500_RST: B1.37(RSTN)
NetB1_10: B1.10(EXRES1) R31.1
NetB1_20: B1.20(TOCAP) C59.1
NetB1_22: B1.22(1V2O) C60.1
NetB1_30: B1.30(XI/CLKIN) C52.1 R30.1 Y2.1
NetB1_31: B1.31(XO) C50.1 R30.2 Y2.3
NetB1_43: B1.43(PMODE2) R24.1
NetB1_44: B1.44(PMODE1) R23.1
NetB1_45: B1.45(PMODE0) R22.1
NetC47_2: C47.2 T1.4(RD+)
NetC48_1: C48.1 R25.2 T1.2(TCT) T1.5(RCT)
NetC49_2: C49.2 T1.6(RD-)
NetC51_1: C51.1 R28.2 R29.2
NetD3_2: D3.2(A) R37.2
NetR26_1: R26.1 T1.9
NetR27_1: R27.1 T1.11

Not connected (* = marked no-connect by the designer): B1 7(DNC)* 12(NC_1)* 13(NC_2)* 18(VBG)* 23(RSVD_1)* 24(SPDLED)* 26(DUPLED)* 38(RSVD_2)* 39(RSVD_3)* 40(RSVD_4)* 41(RSVD_5)* 42(RSVD_6)* 46(NC_3)* 47(NC_4)*; CN1 1* 2* 10*; T1 7(NC)*; U9 1(PA13)* 2(PB3)* 4(PA15)* 5(PA8)* 6(PA27)* 7(PA26)* 10(PA25)* 11(PA7)* 12(PA14)* 13(PA30)* 14(PA12)*

### Notes on the sheet
- Ethernet
- SD Card
- Wi - Fi & BLE
- STDC14
- Labels drawn without touching a wire or pin: NetLabel100

### Library data of the parts
B1 = W5500: Ethernet ICs 3in1 Enet Controller TCP/IP +MAC+PHY; Manufacturer_Name: WIZnet Inc; Geometry.Height: 1.6mm; Manufacturer_Part_Number: W5500; Mouser Part Number: 950-W5500; Mouser Price/Stock: https://www.mouser.co.uk/ProductDetail/WIZnet/W5500?qs=2vh%252B45pPFtzthUpYPd4pqA%3D%3D; Arrow Part Number: *; Arrow Price/Stock: *; Datasheet Link: http://wizwiki.net/wiki/lib/exe/fetch.php?media=products:w5500:w5500_ds_v106e_141230.pdf
B2 = PESD3V3L1BA_115: PESD3V3L1BA - Low capacitance bidirectional ESD protection diode in SOD323; Manufacturer_Name: Nexperia; Manufacturer_Part_Number: PESD3V3L1BA,115; Geometry.Height: 1.1mm; Mouser Part Number: 771-PESD3V3L1BA-T/R; Mouser Price/Stock: https://www.mouser.co.uk/ProductDetail/Nexperia/PESD3V3L1BA115?qs=LOCUfHb8d9tfcQwAsqvzKg%3D%3D; Arrow Part Number: PESD3V3L1BA,115; Arrow Price/Stock: https://www.arrow.com/en/products/pesd3v3l1ba115/nexperia?region=nac; Datasheet Link: https://assets.nexperia.com/documents/data-sheet/PESDXL1BA_SER.pdf
C44 C53-C58 C62 C63 = CMP-13271-004036-1: as C23 on sheet MCU; Mount: Surface Mount; Packaging: Cut Tape; Width: 0.031inch; Thickness: 0.035inch; Length: 0.063inch; Tolerance: 10%; Min Operating Temperature: -55°C; Case/Package: 0603; Voltage Rating: 100V; Max Operating Temperature: 125°C; Case Code (Metric): 1608; Capacitance: 100nF; Case Code (Imperial): 0603
C45 C46 C61 = CMP-13271-004224-1: as C24 on sheet MCU; Width: 0.031inch; Voltage Rating: 25V; Length: 0.063inch; Case Code (Metric): 1608; Dielectric: X5R; Termination: Wraparound; Capacitance: 10uF; Lead Free: Lead Free; Mount: Surface Mount; Package Quantity: 1; Case Code (Imperial): 0603; Thickness: 0.035inch; Packaging: Tape and Reel; Contact Plating: Tin; Min Operating Temperature: -55°C; Tolerance: 20%; Max Operating Temperature: 85°C; Case/Package: 0603
C47 C49 = CMP-03422-000576-1: CAP CER 6800PF 50V X7R 0603; Manufacturer Part Number: CC0603KRX7R9BB682; Manufacturer: YAGEO; Temperature Coefficient: 15%; Tolerance: 0.1; Material: Ceramic; Digikey Description: CAP CER 6800PF 50V X7R 0603; Footprint Url: http://www.yageo.com/exep/pages/download/literatures/UPY-C_GEN_24.pdf; Automotive: No; Octopart: https://octopart.com/cc0603krx7r9bb682-yageo-39467723; Lead Free: Yes; Temperature: -55°C to +125°C; RoHS: TRUE; Temperature Range High: +125°C; Package: CC0603-DA; Value: 6.8 nF; Height: 0.9mm; Temperature Range Low: -55°C; ComponentLink2Description: Datasheet; Category: Cap; Device Class L1: Passive Components; Device Class L2: Capacitors; Voltage: 50 V; Temperature Characteristic: X7R; Capacitance: 6.8 nF; Device Class L3: Ceramic Capacitors; Mouser Description: Multilayer Ceramic Capacitors MLCC - SMD/SMT 6.8nF 50V X7R 10%; Voltage Rating: 50 V; ComponentLink2URL: http://www.yageo.com/documents/recent/UPY-GPHC_X7R_6.3V-to-50V_18.pdf
C48 = CMP-2100-03602-3: CAP CER 0.022UF 50V X7R 0603; Dielectric Material: Ceramic; Insulation Resistance: 100GR; Tolerance: 10%; Thickness: 0.035inch; Case/Package: 0603; Packaging: Tape and Reel; Voltage Rating (DC): 50V; Length: 1.6mm; Depth: 0.8mm; Dielectric: X7R; Resistor Type: Ceramic; Min Operating Temperature: -55°C; Number of Pins: 2; Series: CC; Mount: Surface Mount; Max Operating Temperature: 125°C; Capacitance: 22nF; Case Code (Imperial): 0603; Width: 0.031inch; Halogen Free: Halogen Free; Lead Free: Lead Free; Voltage: 50V; RoHS Compliant: Yes; Package Quantity: 1; Height: 0.8mm; REACH SVHC: No SVHC; Voltage Rating: 50V; Case Code (Metric): 1608; Termination: SMD/SMT; Radiation Hardening: No
C50 C52 = CMP-08246-003585-1: Multilayer Ceramic Capacitors 18pF ±5% 50V C0G SMD 0603; Temperature Coefficient: 30ppm/°C; Height: 0.8mm; Packaging: Tape and Reel; Capacitance: 18pF; Min Operating Temperature: -55°C; Lead Free: Lead Free; Depth: 0.8mm; Length: 1.6mm; Voltage Rating: 50V; Weight: 7.1E-05oz; Radiation Hardening: No; Max Operating Temperature: 125°C; Voltage: 50V; Dielectric: C0G; Voltage Rating (DC): 50V; Case Code (Imperial): 0603; Number of Pins: 2; Mount: Surface Mount; Tolerance: 5%; Width: 0.031inch; RoHS Compliant: Yes; Series: C; Thickness: 0.037inch; Construction: Flat; Case Code (Metric): 1608; Case/Package: 0603; Package Quantity: 1; Dielectric Material: Ceramic; REACH SVHC: No SVHC; Termination: SMD/SMT
C51 C60 = CMP-2100-03600-2: as C19 on sheet MCU; Mouser Description: Multilayer Ceramic Capacitor, CC Series, 0.01 - F, - 10%, X7R, 50 V, 0603 [1608 Metric]; Digikey Description: CAP CER 10000PF 50V X7R 0603; Height: 0.9mm; Category: Cap; Temperature Characteristic: X7R; Footprint Url: http://www.yageo.com/exep/pages/download/literatures/UPY-C_GEN_24.pdf; Lead Free: Yes; Voltage Rating: 50 V; Temperature: -55°C to +125°C; Device Class L3: Ceramic Capacitors; ComponentLink2Description: Datasheet; Voltage: 50 V; Package: CC0603-DA; Octopart: https://octopart.com/cc0603krx7r9bb103-yageo-192938; Automotive: No; Temperature Range High: +125°C; Temperature Range Low: -55°C; Value: 10 nF; RoHS: TRUE; Device Class L1: Passive Components; ComponentLink2URL: http://www.yageo.com/documents/recent/UPY-GPHC_X7R_6.3V-to-50V_18.pdf; Device Class L2: Capacitors; Capacitance: 10 nF
C59 = CMP-2006-02256-2: CAP CER 4.7UF 6.3V X5R 0603; Manufacturer: Kemet; Manufacturer Part Number: C0603C475K9PACTU; Temperature Coefficient: 15%; Tolerance: 10%; Material: Ceramic; Device Class L3: Ceramic Capacitors; RoHS: TRUE; Value: 4.7uF; Lead Free: Yes; ComponentLink2Description: Datasheet; Mouser Description: Multilayer Ceramic Capacitors MLCC - SMD/SMT 6.3volts 4.7uF X5R 10%; Package: C0603-CG; Digikey Description: CAP CER 4.7UF 6.3V X5R 0603; ComponentLink2URL: https://content.kemet.com/datasheets/KEM_C1006_X5R_SMD.pdf; Category: Cap; Temperature Range Low: -55°C; Capacitance: 4.7uF; Temperature: -55°C to +85°C; Octopart: https://octopart.com/c0603c475k9pactu-kemet-104242; Ipc Land Pattern Name: CAPC16080X80; Voltage Rating: 6.3V; Temperature Range High: +85°C; Height: 0.9mm; Temperature Characteristic: X5R; Device Class L1: Passive Components; Automotive: No; Device Class L2: Capacitors
CN1 = STDC-14
D3 = CMP-1426-00002-3: as D1 on sheet MCU; Mount: Surface Mount; Height: 700µm; Lead Free: Lead Free; Min Operating Temperature: -40°C; Max Operating Temperature: 85°C; Length: 1.6mm; Width: 800µm; Case/Package: 0603; Case Code (Imperial): 0603; Case Code (Metric): 1608; Packaging: Tape and Reel; Reverse Voltage: 5V; REACH SVHC: Unknown; RoHS: Compliant
FB1 = CMP-0686-00436-3: Chip Ferrite Bead, 0603, 600Ω @ 100MHz, 0.38Ω, 25%, 500mA; Number of Lines: 1; DC Resistance (DCR): 380mR; Material: Steel; Shielding: Unshielded; Max DC Current: 500mA; Termination: SMD/SMT; Military Standard: Not; Number of Circuits: 1; Min Operating Temperature: -55°C; Case Code (Imperial): 0603; Width: 0.8mm; Current Rating: 500mA; Lead Free: Lead Free; Packaging: Tape and Reel; Frequency: 100MHz; Max Operating Temperature: 125°C; DC Current: 500mA; REACH SVHC: No SVHC; Case/Package: 0603; Package Quantity: 1; Height: 0.8mm; Number of Pins: 2; Impedance: 600R; Depth: 0.8mm; Test Frequency: 100MHz; Case Code (Metric): 1608; Tolerance: 25%; Core Material: Ferrite; Weight: 7.1E-05oz; Max Current Rating: 500mA; Radiation Hardening: No; Length: 1.6mm; RoHS Compliant: Yes
R20 R21 R28 R29 = CMP-03412-034007-1: RES SMD 49.9OHM 0.05% 1/10W 0603; Manufacturer: Yageo; Manufacturer Part Number: RT0603WRE0749R9L; Voltage Rating: 75V; Tolerance: 0.0005; Power Rating: 0.1W; Resistance: 49.9Ω; Temperature Coefficient: 50 ppm/°C; Value: 49.9Ω; RoHS: TRUE; Temperature Range Low: -55°C; Device Class L2: Resistors; Device Class L1: Passive Components; Footprint Url: http://www.yageo.com/exep/pages/download/literatures/PYu-R_Mount_10.pdf; Series: RT; Category: Res; Lead Free: Yes; Temperature: -55°C to +155°C; Octopart: https://octopart.com/rt0603wre0749r9l-yageo-71397127; Device Class L3: Chip SMD Resistors; Height: 0.55mm; Digikey Description: RES SMD 49.9OHM 0.05% 1/10W 0603; ComponentLink2Description: Datasheet; ComponentLink2URL: http://www.yageo.com/documents/recent/PYu-RT_1-to-0.01_RoHS_L_9.pdf; Automotive: No; Package: RT0603; Composition: Thin Film; Ipc Land Pattern Name: RESC16080X45; Temperature Range High: +155°C
R22-R24 = CMP-1659-00055-2: RES SMD 47K OHM 1% 1/10W 0603; Voltage Rating: 50V; Temperature Coefficient: 100ppm/°C; Max Power Dissipation: 100mW; Resistance: 47kR; Voltage Rating (DC): 50V; Min Operating Temperature: -55°C; Packaging: Tape and Reel; Features: Moisture Resistant; Termination: SMD/SMT; Technology: THICK FILM; Lead Free: Lead Free; Max Operating Temperature: 155°C; Width: 0.031inch; Case Code (Metric): 1608; Tolerance: 1%; Package Quantity: 1; Resistor Type: Thick Film; RoHS Compliant: Yes; Case/Package: 0603; Case Code (Imperial): 0603; Resistance Tolerance: 1%; Length: 0.063inch; Series: RC; Number of Pins: 2; Power Rating: 100mW; Number of Terminations: 2; Construction: Rectangular; Height: 0.022inch; Military Standard: Not; Size Code: 0603; Depth: 0.8mm
R25 = CMP-2000-04609-2: RES SMD 10 OHM 0.5% 1/10W 0603; Manufacturer: Yageo; Manufacturer Part Number: RT0603DRE0710RL; Voltage Rating: 75V; Tolerance: 0.005; Temperature Coefficient: 50 ppm/°C; Resistance: 10Ω; Power Rating: 0.1W; Value: 10Ω; Temperature Range Low: -55°C; RoHS: TRUE; Device Class L1: Passive Components; Footprint Url: http://www.yageo.com/exep/pages/download/literatures/PYu-R_Mount_10.pdf; Device Class L3: Chip SMD Resistors; Device Class L2: Resistors; Series: RT; ComponentLink2URL: http://www.yageo.com/documents/recent/PYu-RT_1-to-0.01_RoHS_L_9.pdf; Octopart: https://octopart.com/rt0603dre0710rl-yageo-1192091; Automotive: No; ComponentLink2Description: Datasheet; Ipc Land Pattern Name: RESC16080X45; Package: RT0603; Lead Free: Yes; Temperature: -55°C to +155°C; Category: Res; Height: 0.55mm; Temperature Range High: +155°C; Digikey Description: RES SMD 10 OHM 0.5% 1/10W 0603; Composition: Thin Film
R26 R27 = CMP-03412-020221-1: RES SMD 270 OHM 1% 1/10W 0603; Manufacturer: Yageo; Manufacturer Part Number: RT0603FRE07270RL; Voltage Rating: 75V; Resistance: 270Ω; Tolerance: 0.01; Power Rating: 0.1W; Temperature Coefficient: 50 ppm/°C; Value: 270Ω; Footprint Url: http://www.yageo.com/exep/pages/download/literatures/PYu-R_Mount_10.pdf; RoHS: TRUE; Automotive: No; Ipc Land Pattern Name: RESC16080X45; Series: RT; Temperature: -55°C to +155°C; Composition: Thin Film; Temperature Range Low: -55°C; Device Class L2: Resistors; Device Class L3: Chip SMD Resistors; Octopart: https://octopart.com/rt0603fre07270rl-yageo-40014674; Mouser Description: RT Series 0603 0.1 W 27 Ohm ±1 % ±50 ppm/°C SMT Thin Film Chip Resistor; Temperature Range High: +155°C; Height: 0.55mm; ComponentLink2URL: http://www.yageo.com/documents/recent/PYu-RT_1-to-0.01_RoHS_L_9.pdf; Package: RT0603; Device Class L1: Passive Components; Lead Free: Yes; Digikey Description: RES SMD 270 OHM 1% 1/10W 0603; ComponentLink2Description: Datasheet; Category: Res
R30 = CMP-2000-06953-2: RES SMD 1M OHM 5% 1/10W 0603; Voltage Rating (DC): 50V; Power Rating: 100mW; Temperature Coefficient: 100ppm/°C; Resistance: 1MR; Features: Moisture Resistant; Package Quantity: 5000; Case Code (Imperial): 0603; Packaging: Tape and Reel; Resistor Type: Thick Film; Number of Pins: 2; Size Code: 0603; Resistance Tolerance: 5%; Max Operating Temperature: 155°C; Voltage Rating: 50V; Depth: 0.8mm; Termination: SMD/SMT; Width: 0.8mm; RoHS Compliant: Yes; Number of Terminations: 2; Height: 0.45mm; Lead Free: Lead Free; Case/Package: 0603; Military Standard: Not; Min Operating Temperature: -55°C; Case Code (Metric): 1608; Radiation Hardening: No; Series: RC; Length: 1.6mm; Tolerance: 5%; REACH SVHC: No SVHC; Contact Plating: Tin; Construction: Rectangular; Max Power Dissipation: 100mW
R31 = 4.7R 0603: SMT Resistor
R32-R36 R38 R39 = CMP-2100-03664-2: as R16 on sheet MCU; Depth: 0.8mm; Termination: SMD/SMT; Resistor Type: Thick Film; Series: RC; Construction: Rectangular; Features: Moisture Resistant; Packaging: Tape and Reel; Min Operating Temperature: -55°C; Number of Terminations: 2; Lead Pitch: 0.3mm; RoHS Compliant: Yes; Case/Package: 0603; Resistance Tolerance: 1%; Military Standard: Not; Weight: 7.1E-05oz; Number of Pins: 2; Tolerance: 1%; Length: 1.6mm; Case Code (Imperial): 0603; Lead Free: Lead Free; Width: 0.8mm; Max Power Dissipation: 100mW; Height: 0.45mm; Max Operating Temperature: 155°C; Case Code (Metric): 1608; Size Code: 0603
R37 = CMP-2000-06942-1: as R18 on sheet MCU; Package Reference: 0603; Series: RC; Datasheet Version: Rev. 7, 05/2017; Packaging: Reel; Termination Style: SMD/SMT; Datasheet URL: http://www.yageo.com/documents/recent/PYu-RC_Group_51_RoHS_L_7.pdf; Manufacturer URL: http://www.yageo.com/; Package Description: 2-Pin Surface Mount Device, Body 1.6 x 0.8 mm; Case Code - mm: 1608; Case Code - in: 0603; Mounting Technology: SurfaceMount; Operating Temperature Range: -55Cto+155C; Tolerance: 1%; Product: ThickFilmResistorsGeneralPurpose
T1 = CMP-03913-20254625-2: 7499010121A Telecom and Datacom Connector, 8 Contact(s), Right Angle, Solder Terminal; Number of Ports: 1; Number of Positions: 8; Shielding: Shielded; Pitch: 2.54mm; Insertion Loss (dB): -1dB; Inductance: 350µH; Number of Cores per Jack: 4; Color: Green, Silver, Yellow; Direction: Up; Connector Type: RJ45, Socket; Gender: Female; Min Operating Temperature: 0°C; Contact Plating: Gold; Case/Package: Metal; Number of Contacts: 8; REACH SVHC: No SVHC; Housing Material: Thermoplastic; NexarPartId: 20254625; Depth: 25.3mm; Max Operating Temperature: 70°C; Width: 16mm; Length: 25mm; Number of Rows: 1; Lead Free: Lead Free; RoHS: Compliant; Termination: Through Hole; Mount: PCB, Through Hole; Flammability Rating: UL94 V-0; Contact Material: Ferrite, Gold; Height: 14mm
TF1 = TF-SMD
Y2 = CMP-2000-05733-3: Crystal 25MHz ±20ppm (Tol) ±30ppm (Stability) 18pF FUND 60Ω 4-Pin SMD T/R; Series Resistance: 60R; Length: 3.2mm; Depth: 2.5mm; Packaging: Tape and Reel; Min Operating Temperature: -40°C; Operating Frequency: 25 MHz; Lead Free: Lead Free; Number of Pins: 4; Frequency Tolerance: 20ppm; Radiation Hardening: No; Max Operating Temperature: 85°C; Termination: SMD/SMT; Frequency Stability: 30ppm; Frequency: 25MHz; Series: ABM8G; Mount: Surface Mount; Package Quantity: 1000; Height: 0.039inch; Width: 0.098inch; Case/Package: CSMD; ESR (Equivalent Series Resistance): 60R; Load Capacitance: 18pF; Tolerance: 20ppm